# EAGLE schematic CS4270-breakout (EAGLE 9.4.0)
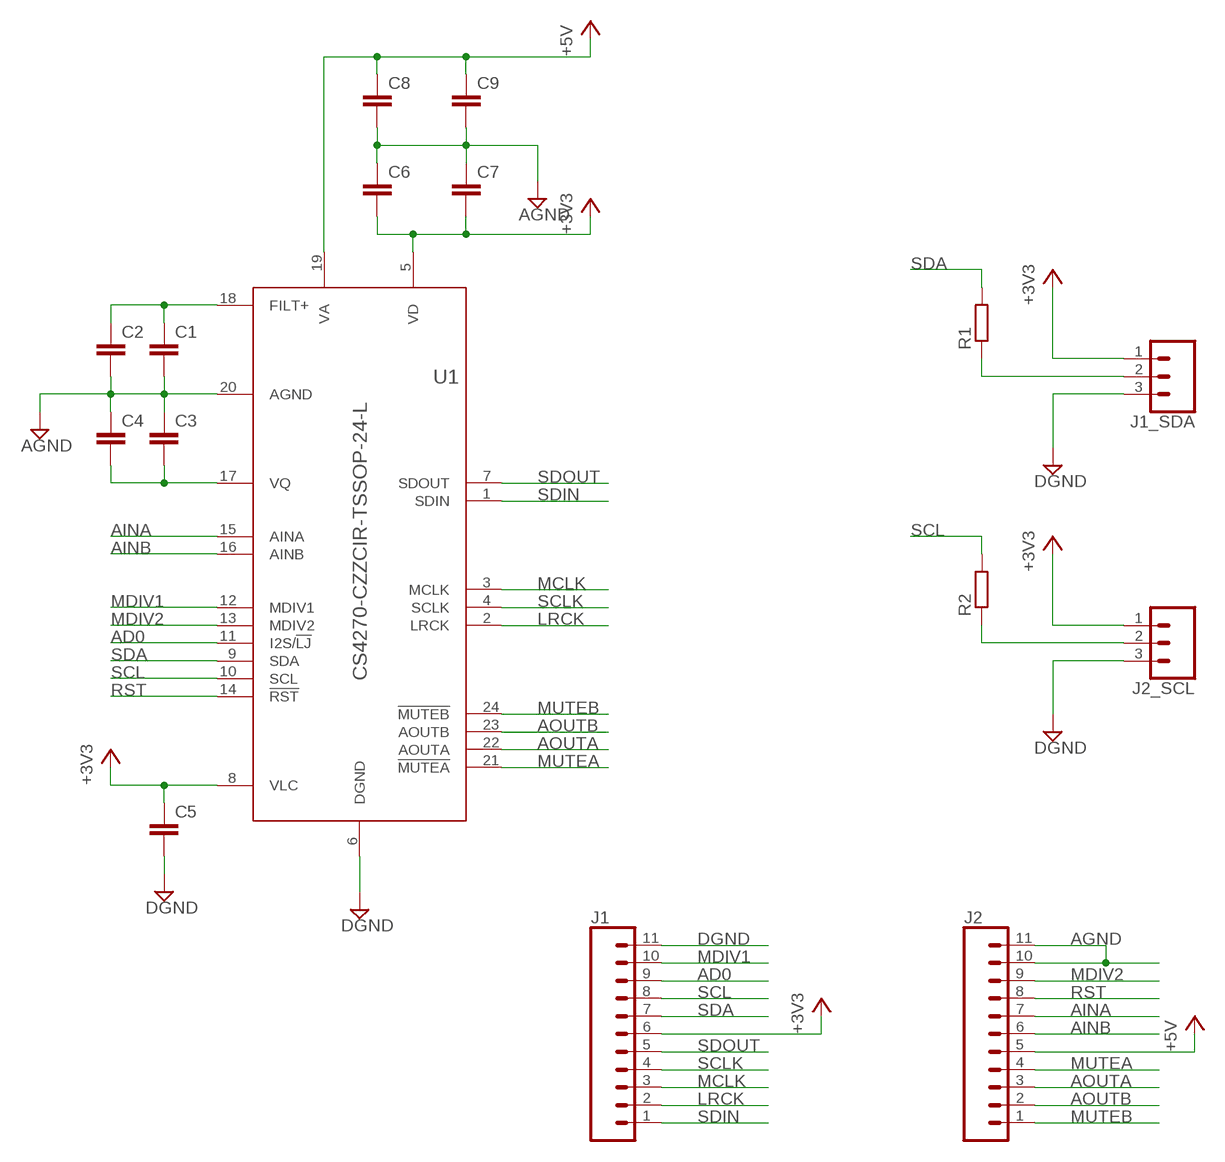
[diagram p0: schematic, sheet 1]

## Parts
C1  CAPACITOR-EUC0603  [C0603]
C2  CAPACITOR-EUC0805  [C0805]
C3  CAPACITOR-EUC0603  [C0603]
C4  CAPACITOR-EUC0805  [C0805]
C5  CAPACITOR-EUC0603  [C0603]
C6  CAPACITOR-EUC0603  [C0603]
C7  CAPACITOR-EUC0603  [C0603]
C8  CAPACITOR-EUC0603  [C0603]
C9  CAPACITOR-EUC0603  [C0603]
J1  CONN_11LOCK  [1X11_LOCK]
J1_SDA  CONN_03LOCK  [1X03_LOCK]
J2  CONN_11LOCK  [1X11_LOCK]
J2_SCL  CONN_03LOCK  [1X03_LOCK]
R1  RESISTOR-EU_R0603  [R0603]
R2  RESISTOR-EU_R0603  [R0603]
U1  CS4270-CZZCIR-TSSOP-24-L  [CIR-TSSOP-24-L]

## Nets
+3V3: C5.1 C6.2 C7.2 J1.6 J1_SDA.1 J2_SCL.1 U1.5(VD) U1.8(VLC)
+5V: C8.1 C9.1 J2.5 U1.19(VA)
AD0: J1.9 U1.11(I2S/!LJ)
AGND: C1.2 C2.2 C3.1 C4.1 C6.1 C7.1 C8.2 C9.2 J2.10 J2.11 U1.20(AGND)
AINA: J2.7 U1.15(AINA)
AINB: J2.6 U1.16(AINB)
AOUTA: J2.3 U1.22(AOUTA)
AOUTB: J2.2 U1.23(AOUTB)
DGND: C5.2 J1.11 J1_SDA.3 J2_SCL.3 U1.6(DGND)
LRCK: J1.2 U1.2(LRCK)
MCLK: J1.3 U1.3(MCLK)
MDIV1: J1.10 U1.12(MDIV1)
MDIV2: J2.9 U1.13(MDIV2)
MUTEA: J2.4 U1.21(!MUTEA)
MUTEB: J2.1 U1.24(!MUTEB)
N$18: J1_SDA.2 R1.1
N$19: C1.1 C2.1 U1.18(FILT+)
N$21: C3.2 C4.2 U1.17(VQ)
N$22: J2_SCL.2 R2.1
RST: J2.8 U1.14(!RST)
SCL: J1.8 R2.2 U1.10(SCL)
SCLK: J1.4 U1.4(SCLK)
SDA: J1.7 R1.2 U1.9(SDA)
SDIN: J1.1 U1.1(SDIN)
SDOUT: J1.5 U1.7(SDOUT)

## Library data of the parts
C1-C9 = 0000-master:CAPACITOR-EU: CAPACITOR, European symbol
J1 J2 = SparkFun-Connectors:CONN_11: Multi connection point. Often used as Generic Header-pin footprint for 0.1 inch spaced/style header connections On any of the 0.1 inch spaced packages, you can populate with these: Break Away Headers - Straight <https://www.sparkfun.com/products/116> (PRT-00116) Break Away Male Headers - Right Angle <https://www.sparkfun.com/products/553> (PRT-00553) Female Headers <https://www.sparkfun.com/products/115> (PRT-00115) Break Away Headers - Machine Pin <https://www.sparkfun.com/products/117> (PRT-00117) Break Away Female Headers - Swiss Machine Pin <https://www.sparkfun.com/products/743> (PRT-00743) For SCREWTERMINALS and SPRING TERMINALS visit here: Screw Terimnals on SparkFun.com <https://www.sparkfun.com/search/results?term=Screw+Terminals> (5mm/3.5mm/2.54mm spacing) This device is also useful as a general connection point to wire up your design to another part of your project. Our various solder wires solder well into these plated through hole pads. Hook-Up Wire - Assortment (Stranded, 22 AWG) <https://www.sparkfun.com/products/11375> (PRT-11375) Hook-Up Wire - Assortment (Solid Core, 22 AWG) <https://www.sparkfun.com/products/11367> (PRT-11367) View the entire wire category on our website here <https://www.sparkfun.com/categories/141>
J1_SDA J2_SCL = SparkFun-Connectors:CONN_03: Multi connection point. Often used as Generic Header-pin footprint for 0.1 inch spaced/style header connections On any of the 0.1 inch spaced packages, you can populate with these: Break Away Headers - Straight <https://www.sparkfun.com/products/116> (PRT-00116) Break Away Male Headers - Right Angle <https://www.sparkfun.com/products/553> (PRT-00553) Female Headers <https://www.sparkfun.com/products/115> (PRT-00115) Break Away Headers - Machine Pin <https://www.sparkfun.com/products/117> (PRT-00117) Break Away Female Headers - Swiss Machine Pin <https://www.sparkfun.com/products/743> (PRT-00743) Stackable Header - 3 Pin (Female, 0.1") <https://www.sparkfun.com/products/13875> (PRT-13875) For SCREWTERMINALS and SPRING TERMINALS visit here: Screw Terimnals on SparkFun.com <https://www.sparkfun.com/search/results?term=Screw+Terminals> (5mm/3.5mm/2.54mm spacing) This device is also useful as a general connection point to wire up your design to another part of your project. Our various solder wires solder well into these plated through hole pads. Hook-Up Wire - Assortment (Stranded, 22 AWG) <https://www.sparkfun.com/products/11375> (PRT-11375) Hook-Up Wire - Assortment (Solid Core, 22 AWG) <https://www.sparkfun.com/products/11367> (PRT-11367) View the entire wire category on our website here <https://www.sparkfun.com/categories/141> Special notes: Molex polarized connector foot print use with SKU : PRT-08232 with associated crimp pins and housings.
R1 R2 = 0000-master:RESISTOR-EU_: RESISTOR, European symbol
U1 = 0000-master:CS4270-CZZ; MANUFACTURER_PART_NUMBER: CS4270CZZ; VENDOR: Cirrus Logic